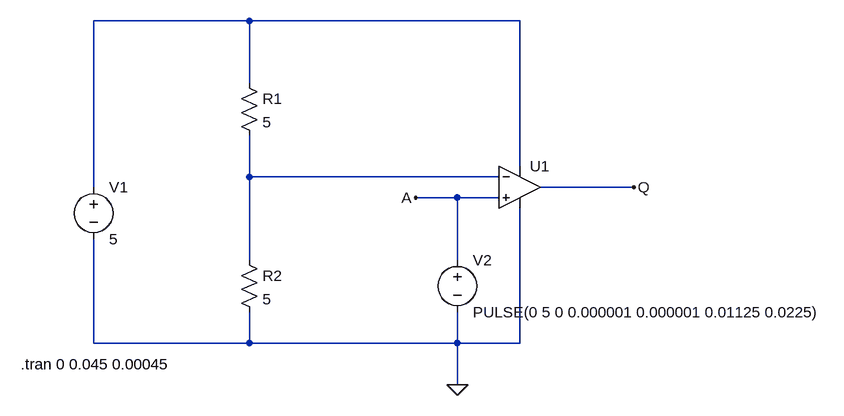
[diagram p0: schematic excercise1.asc]
excercise1.asc, the LTspice schematic file:
Version 4
SHEET 1 1280 680
WIRE 272 -96 32 -96
WIRE 688 -96 272 -96
WIRE 272 0 272 -96
WIRE 688 128 688 -96
WIRE 272 144 272 80
WIRE 656 144 272 144
WIRE 32 160 32 -96
WIRE 864 160 720 160
WIRE 592 176 528 176
WIRE 656 176 592 176
WIRE 272 272 272 144
WIRE 592 272 592 176
WIRE 32 400 32 240
WIRE 272 400 272 352
WIRE 272 400 32 400
WIRE 592 400 592 352
WIRE 592 400 272 400
WIRE 688 400 688 192
WIRE 688 400 592 400
WIRE 592 464 592 400
FLAG 528 176 A
FLAG 864 160 Q
FLAG 592 464 0
SYMBOL voltage 32 144 R0
WINDOW 123 0 0 Left 0
WINDOW 39 0 0 Left 0
SYMATTR InstName V1
SYMATTR Value 5
SYMBOL res 256 -16 R0
SYMATTR InstName R1
SYMATTR Value 5
SYMBOL res 256 256 R0
SYMATTR InstName R2
SYMATTR Value 5
SYMBOL voltage 592 256 R0
WINDOW 123 0 0 Left 0
WINDOW 39 0 0 Left 0
SYMATTR InstName V2
SYMATTR Value PULSE(0 5 0 0.000001 0.000001 0.01125 0.0225)
SYMBOL OpAmps\\UniversalOpAmp2 688 160 R0
SYMATTR InstName U1
TEXT -80 432 Left 2 !.tran 0 0.045 0.00045

The netlist it stands for:
* excercise1.asc
V1 N001 0 5
R1 N001 N002 5
R2 N002 0 5
V2 A 0 PULSE(0 5 0 0.000001 0.000001 0.01125 0.0225)
XU1 A N002 N001 0 Q level2 Avol=1Meg GBW=10Meg Slew=10Meg Ilimit=25m Rail=0 Vos=0 En=0 Enk=0 In=0 Ink=0 Rin=500Meg  ; pins In+ In- V+ V- OUT
.tran 0 0.045 0.00045
.lib UniversalOpAmp2.lib
.backanno
.end